# Altium schematic sheet DDR3_2.SchDoc: DDR3 memory
size 420 x 297 mm; CheckedBy: T.Janicki; CompanyName: Creotech Instruments SA; DrawnBy: G.Kasprowicz; Organization: CERN; Address1: European Organization for Nuclear Research; Address2: CH-1211 Geneve 23 - Switzerland; Revision: -; SheetNumber: 4; SheetTotal: 21; EDA_Number: EDA-xxxx; Projet: Simple VME FMC Carrier; ModifiedBy: -; CreateDate: 20/11/2012; CheckedDate: 30/04/2012; Title2: - bank 5 -; DivGrp: BE-CO; Designer: G.Kasprowicz; PageSetup: Record=PageOptions|CenterHorizontal=True|CenterVertical=True|PrintScale=0.95|XCorrection=1.00|YCorrection=1.00|PrintKind=1|BorderSize=5000000|LeftOffset=0|BottomOffset=0|Orientation=2|PaperLength=1000|PaperWidth=1000|Scale=100|PaperSource=15|PrintQuality=600|MediaType=1|DitherType=10|PaperKind=A3|PrintScaleMode=1; ModifiedDate: -
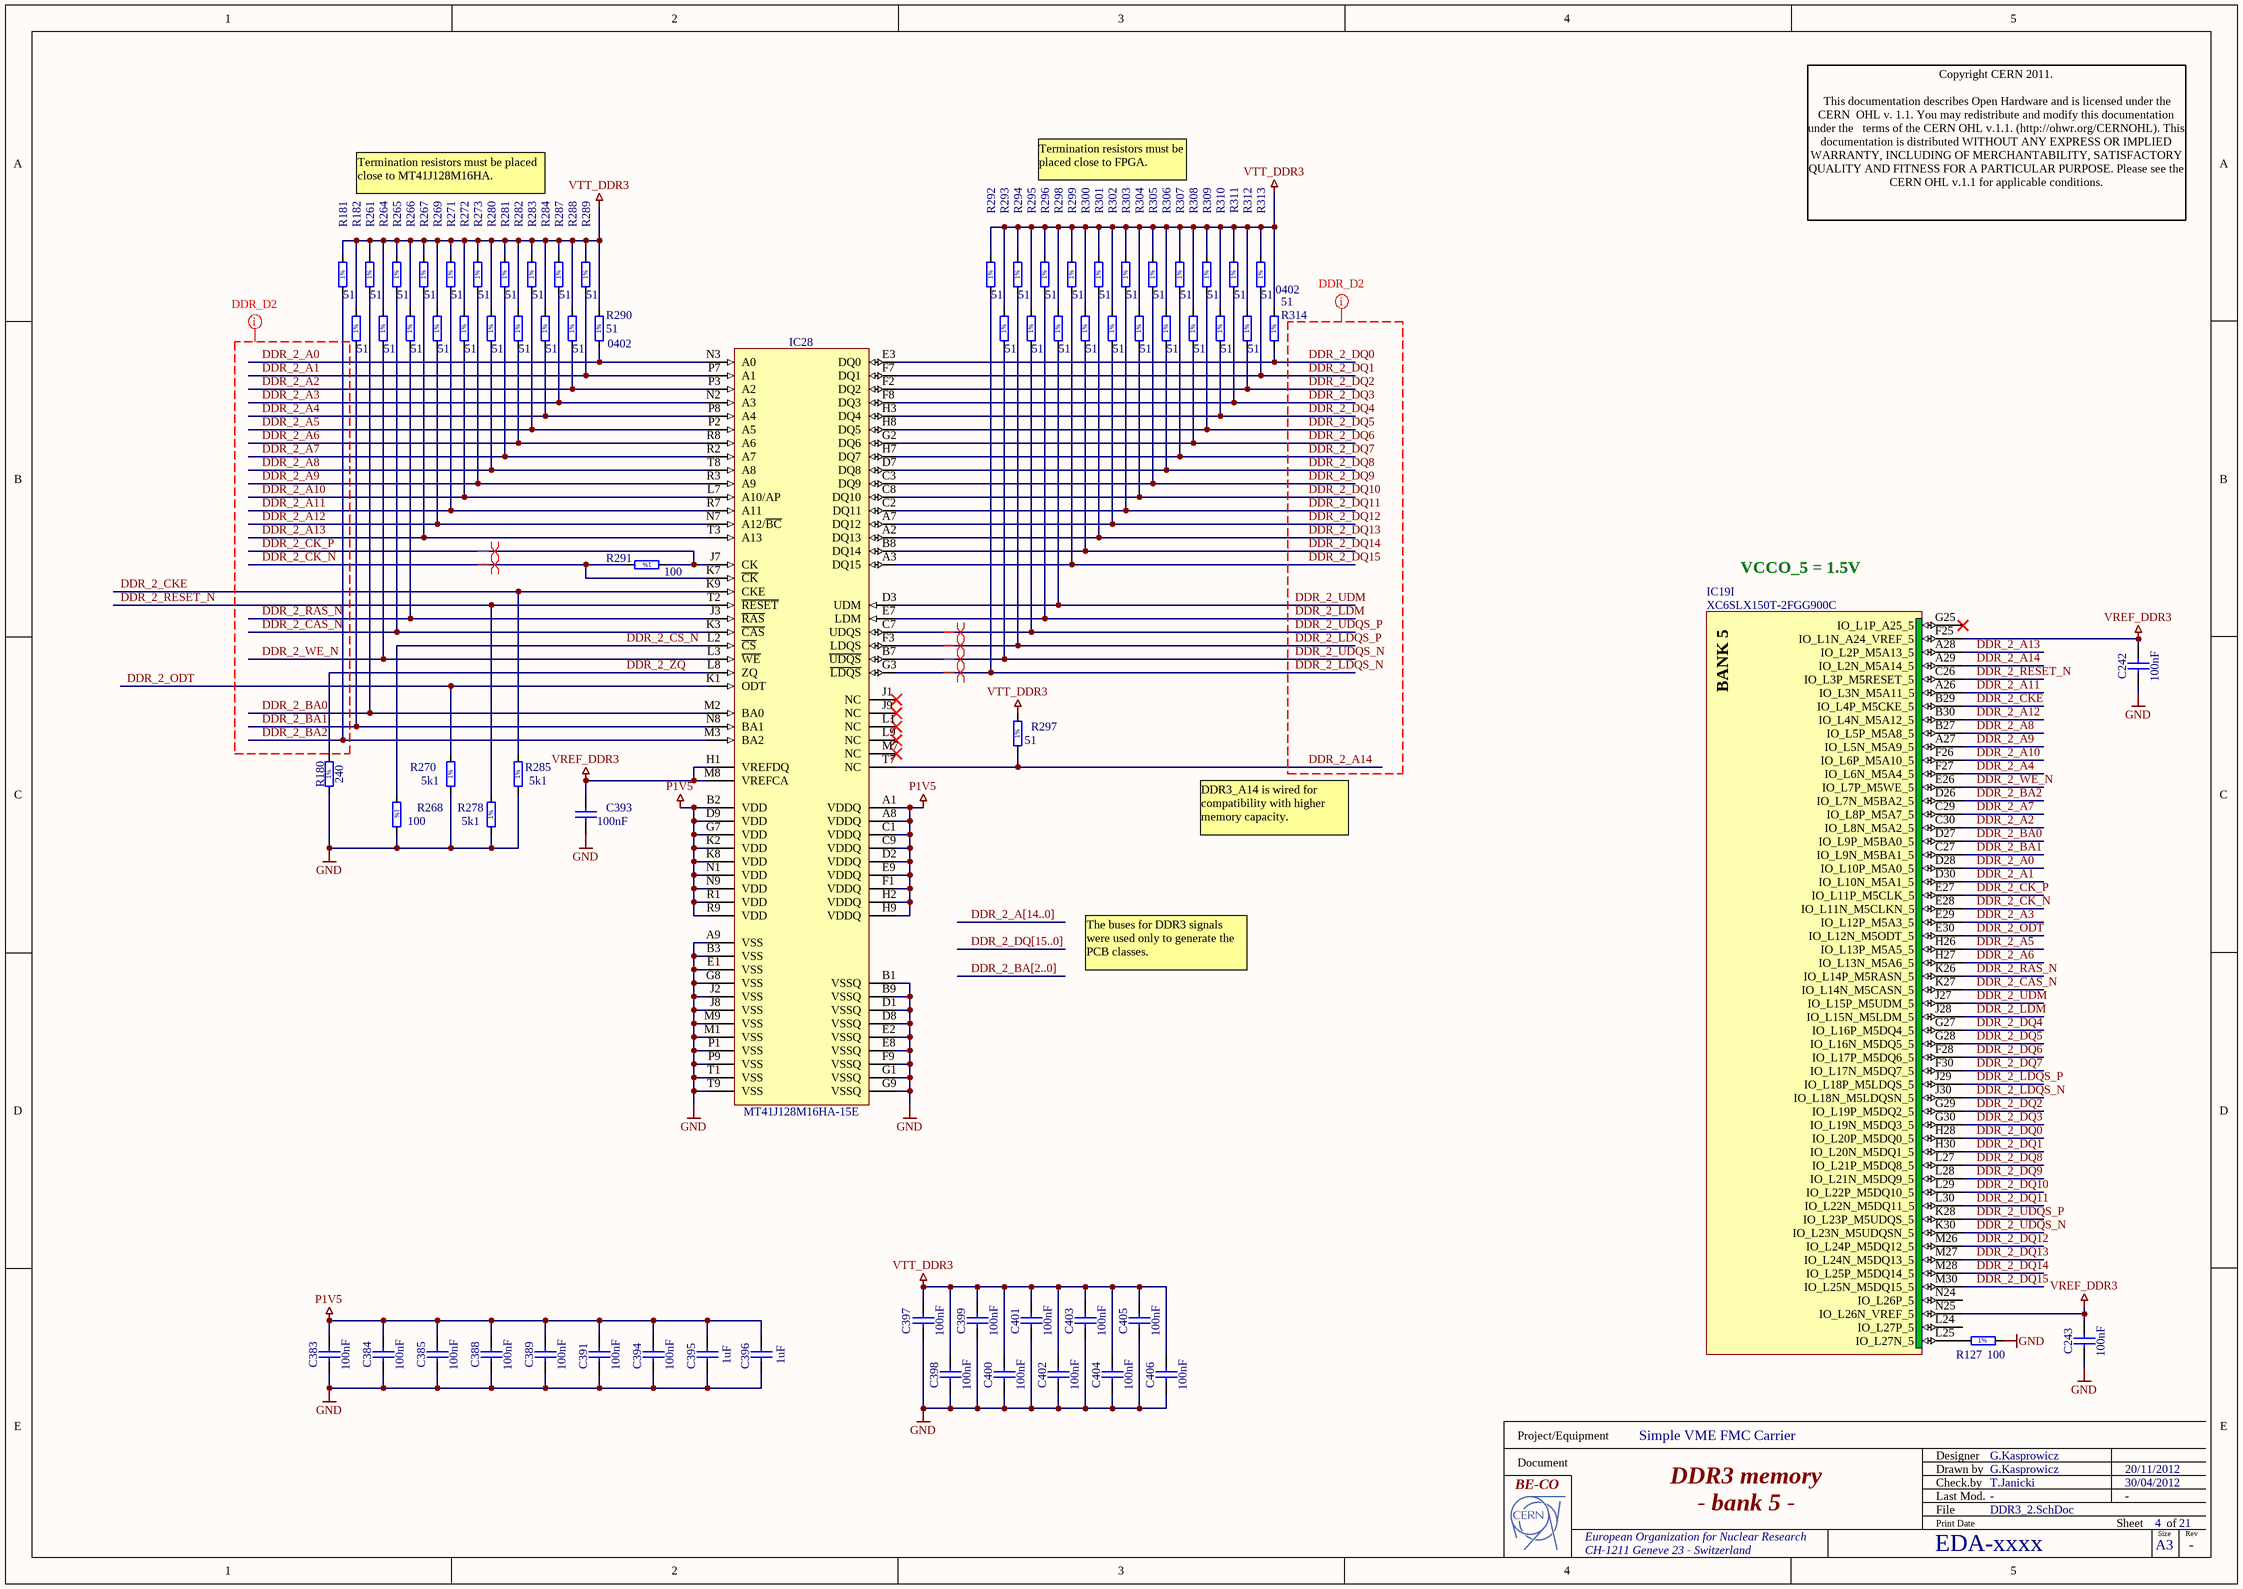
[diagram p0: DDR3_2.SchDoc]

## Parts
C242  100nF  [CAPC1005X55N]
C243  100nF  [CAPC1005X55N]
C383  100nF  [CAPC1005X55N]
C384  100nF  [CAPC1005X55N]
C385  100nF  [CAPC1005X55N]
C388  100nF  [CAPC1005X55N]
C389  100nF  [CAPC1005X55N]
C391  100nF  [CAPC1005X55N]
C393  100nF  [CAPC1005X55N]
C394  100nF  [CAPC1005X55N]
C395  1uF  [CAPC1608X87N]
C396  1uF  [CAPC1608X87N]
C397  100nF  [CAPC1005X55N]
C398  100nF  [CAPC1005X55N]
C399  100nF  [CAPC1005X55N]
C400  100nF  [CAPC1005X55N]
C401  100nF  [CAPC1005X55N]
C402  100nF  [CAPC1005X55N]
C403  100nF  [CAPC1005X55N]
C404  100nF  [CAPC1005X55N]
C405  100nF  [CAPC1005X55N]
C406  100nF  [CAPC1005X55N]
IC19  XC6SLX150T-2FGG900C  [BGA900C100P30X30_3100X3100X260]  (part I of 18)
IC28  MT41J128M16HA-15E  [BGA96C80P9X16_900X1400X120]
R127  100  [RESC1608X55N]
R180  240  [RESC1608X55N]
R181  51  [RESC1005X40N]
R182  51  [RESC1005X40N]
R261  51  [RESC1005X40N]
R264  51  [RESC1005X40N]
R265  51  [RESC1005X40N]
R266  51  [RESC1005X40N]
R267  51  [RESC1005X40N]
R268  100  [RESC1608X55N]
R269  51  [RESC1005X40N]
R270  5k1  [RESC1608X55N]
R271  51  [RESC1005X40N]
R272  51  [RESC1005X40N]
R273  51  [RESC1005X40N]
R278  5k1  [RESC1608X55N]
R280  51  [RESC1005X40N]
R281  51  [RESC1005X40N]
R282  51  [RESC1005X40N]
R283  51  [RESC1005X40N]
R284  51  [RESC1005X40N]
R285  5k1  [RESC1608X55N]
R287  51  [RESC1005X40N]
R288  51  [RESC1005X40N]
R289  51  [RESC1005X40N]
R290  51  Case: 0402  [RESC1005X40N]
R291  100  [RESC1608X55N]
R292  51  [RESC1005X40N]
R293  51  [RESC1005X40N]
R294  51  [RESC1005X40N]
R295  51  [RESC1005X40N]
R296  51  [RESC1005X40N]
R297  51  [RESC1005X40N]
R298  51  [RESC1005X40N]
R299  51  [RESC1005X40N]
R300  51  [RESC1005X40N]
R301  51  [RESC1005X40N]
R302  51  [RESC1005X40N]
R303  51  [RESC1005X40N]
R304  51  [RESC1005X40N]
R305  51  [RESC1005X40N]
R306  51  [RESC1005X40N]
R307  51  [RESC1005X40N]
R308  51  [RESC1005X40N]
R309  51  [RESC1005X40N]
R310  51  [RESC1005X40N]
R311  51  [RESC1005X40N]
R312  51  [RESC1005X40N]
R313  51  [RESC1005X40N]
R314  51  Case: 0402  [RESC1005X40N]

## Nets
GND: C242.1 C243.1 C383.1 C384.1 C385.1 C388.1 C389.1 C391.1 C393.1 C394.1 C395.1 C396.1 C397.1 C398.1 C399.1 C400.1 C401.1 C402.1 C403.1 C404.1 C405.1 C406.1 IC28.A9(VSS) IC28.B1(VSSQ) IC28.B3(VSS) IC28.B9(VSSQ) IC28.D1(VSSQ) IC28.D8(VSSQ) IC28.E1(VSS) IC28.E2(VSSQ) IC28.E8(VSSQ) IC28.F9(VSSQ) IC28.G1(VSSQ) IC28.G8(VSS) IC28.G9(VSSQ) IC28.J2(VSS) IC28.J8(VSS) IC28.M1(VSS) IC28.M9(VSS) IC28.P1(VSS) IC28.P9(VSS) IC28.T1(VSS) IC28.T9(VSS) R127.2 R180.1 R268.2 R270.1 R278.1 R285.1
P1V5: C383.2 C384.2 C385.2 C388.2 C389.2 C391.2 C394.2 C395.2 C396.2 IC28.A1(VDDQ) IC28.A8(VDDQ) IC28.B2(VDD) IC28.C1(VDDQ) IC28.C9(VDDQ) IC28.D2(VDDQ) IC28.D9(VDD) IC28.E9(VDDQ) IC28.F1(VDDQ) IC28.G7(VDD) IC28.H2(VDDQ) IC28.H9(VDDQ) IC28.K2(VDD) IC28.K8(VDD) IC28.N1(VDD) IC28.N9(VDD) IC28.R1(VDD) IC28.R9(VDD)
VREF_DDR3: C242.2 C243.2 C393.2 IC19.F25(IO_L1N_A24_VREF_5) IC19.N25(IO_L26N_VREF_5) IC28.H1(VREFDQ) IC28.M8(VREFCA)
VTT_DDR3: C397.2 C398.2 C399.2 C400.2 C401.2 C402.2 C403.2 C404.2 C405.2 C406.2 R181.2 R182.2 R261.2 R264.2 R265.2 R266.2 R267.2 R269.2 R271.2 R272.2 R273.2 R280.2 R281.2 R282.2 R283.2 R284.2 R287.2 R288.2 R289.2 R290.2 R292.2 R293.2 R294.2 R295.2 R296.2 R297.2 R298.2 R299.2 R300.2 R301.2 R302.2 R303.2 R304.2 R305.2 R306.2 R307.2 R308.2 R309.2 R310.2 R311.2 R312.2 R313.2 R314.2
DDR_2_A0: IC19.D28(IO_L10P_M5A0_5) IC28.N3(A0) R290.1
DDR_2_A1: IC19.D30(IO_L10N_M5A1_5) IC28.P7(A1) R289.1
DDR_2_A2: IC19.C30(IO_L8N_M5A2_5) IC28.P3(A2) R288.1
DDR_2_A3: IC19.E29(IO_L12P_M5A3_5) IC28.N2(A3) R287.1
DDR_2_A4: IC19.F27(IO_L6N_M5A4_5) IC28.P8(A4) R284.1
DDR_2_A5: IC19.H26(IO_L13P_M5A5_5) IC28.P2(A5) R283.1
DDR_2_A6: IC19.H27(IO_L13N_M5A6_5) IC28.R8(A6) R282.1
DDR_2_A7: IC19.C29(IO_L8P_M5A7_5) IC28.R2(A7) R281.1
DDR_2_A8: IC19.B27(IO_L5P_M5A8_5) IC28.T8(A8) R280.1
DDR_2_A9: IC19.A27(IO_L5N_M5A9_5) IC28.R3(A9) R273.1
DDR_2_A10: IC19.F26(IO_L6P_M5A10_5) IC28.L7(A10/AP) R272.1
DDR_2_A11: IC19.A26(IO_L3N_M5A11_5) IC28.R7(A11) R271.1
DDR_2_A12: IC19.B30(IO_L4N_M5A12_5) IC28.N7(A12/~{BC}) R269.1
DDR_2_A13: IC19.A28(IO_L2P_M5A13_5) IC28.T3(A13) R267.1
DDR_2_A14: IC19.A29(IO_L2N_M5A14_5) IC28.T7(NC) R297.1
DDR_2_BA0: IC19.D27(IO_L9P_M5BA0_5) IC28.M2(BA0) R261.1
DDR_2_BA1: IC19.C27(IO_L9N_M5BA1_5) IC28.N8(BA1) R182.1
DDR_2_BA2: IC19.D26(IO_L7N_M5BA2_5) IC28.M3(BA2) R181.1
DDR_2_CAS_N: IC19.K27(IO_L14N_M5CASN_5) IC28.K3(~{CAS}) R265.1
DDR_2_CK_N: IC19.E28(IO_L11N_M5CLKN_5) IC28.K7(~{CK}) R291.2
DDR_2_CK_P: IC19.E27(IO_L11P_M5CLK_5) IC28.J7(CK) R291.1
DDR_2_CKE: IC19.B29(IO_L4P_M5CKE_5) IC28.K9(CKE) R285.2
DDR_2_CS_N: IC28.L2(~{CS}) R268.1
DDR_2_DQ0: IC19.H28(IO_L20P_M5DQ0_5) IC28.E3(DQ0) R314.1
DDR_2_DQ1: IC19.H30(IO_L20N_M5DQ1_5) IC28.F7(DQ1) R313.1
DDR_2_DQ2: IC19.G29(IO_L19P_M5DQ2_5) IC28.F2(DQ2) R312.1
DDR_2_DQ3: IC19.G30(IO_L19N_M5DQ3_5) IC28.F8(DQ3) R311.1
DDR_2_DQ4: IC19.G27(IO_L16P_M5DQ4_5) IC28.H3(DQ4) R310.1
DDR_2_DQ5: IC19.G28(IO_L16N_M5DQ5_5) IC28.H8(DQ5) R309.1
DDR_2_DQ6: IC19.F28(IO_L17P_M5DQ6_5) IC28.G2(DQ6) R308.1
DDR_2_DQ7: IC19.F30(IO_L17N_M5DQ7_5) IC28.H7(DQ7) R307.1
DDR_2_DQ8: IC19.L27(IO_L21P_M5DQ8_5) IC28.D7(DQ8) R306.1
DDR_2_DQ9: IC19.L28(IO_L21N_M5DQ9_5) IC28.C3(DQ9) R305.1
DDR_2_DQ10: IC19.L29(IO_L22P_M5DQ10_5) IC28.C8(DQ10) R304.1
DDR_2_DQ11: IC19.L30(IO_L22N_M5DQ11_5) IC28.C2(DQ11) R303.1
DDR_2_DQ12: IC19.M26(IO_L24P_M5DQ12_5) IC28.A7(DQ12) R302.1
DDR_2_DQ13: IC19.M27(IO_L24N_M5DQ13_5) IC28.A2(DQ13) R301.1
DDR_2_DQ14: IC19.M28(IO_L25P_M5DQ14_5) IC28.B8(DQ14) R300.1
DDR_2_DQ15: IC19.M30(IO_L25N_M5DQ15_5) IC28.A3(DQ15) R299.1
DDR_2_LDM: IC19.J28(IO_L15N_M5LDM_5) IC28.E7(LDM) R296.1
DDR_2_LDQS_N: IC19.J30(IO_L18N_M5LDQSN_5) IC28.G3(~{LDQS}) R292.1
DDR_2_LDQS_P: IC19.J29(IO_L18P_M5LDQS_5) IC28.F3(LDQS) R294.1
DDR_2_ODT: IC19.E30(IO_L12N_M5ODT_5) IC28.K1(ODT) R270.2
DDR_2_RAS_N: IC19.K26(IO_L14P_M5RASN_5) IC28.J3(~{RAS}) R266.1
DDR_2_RESET_N: IC19.C26(IO_L3P_M5RESET_5) IC28.T2(~{RESET}) R278.2
DDR_2_UDM: IC19.J27(IO_L15P_M5UDM_5) IC28.D3(UDM) R298.1
DDR_2_UDQS_N: IC19.K30(IO_L23N_M5UDQSN_5) IC28.B7(~{UDQS}) R293.1
DDR_2_UDQS_P: IC19.K28(IO_L23P_M5UDQS_5) IC28.C7(UDQS) R295.1
DDR_2_WE_N: IC19.E26(IO_L7P_M5WE_5) IC28.L3(~{WE}) R264.1
DDR_2_ZQ: IC28.L8(ZQ) R180.2
NetIC19_L25: IC19.L25(IO_L27N_5) R127.1

Not connected (* = marked no-connect by the designer): IC19 G25(IO_L1P_A25_5)* L24(IO_L27P_5) N24(IO_L26P_5); IC28 J1(NC)* J9(NC)* L1(NC)* L9(NC)* M7(NC)*

## Buses and harness runs
bus DDR_2_A[14..0]
bus DDR_2_BA[2..0]
bus DDR_2_DQ[15..0]

## Layout directives
differential pair: DDR_2_CK_N, DDR_2_CK_P, DDR_2_LDQS_N, DDR_2_LDQS_P, DDR_2_UDQS_N, DDR_2_UDQS_P
net class DDR_D2: DDR_2_A0, DDR_2_A1, DDR_2_A2, DDR_2_A3, DDR_2_A4, DDR_2_A5, DDR_2_A6, DDR_2_A7, DDR_2_A8, DDR_2_A9, DDR_2_A10, DDR_2_A11, DDR_2_A12, DDR_2_A13, DDR_2_A14, DDR_2_BA0, DDR_2_BA1, DDR_2_BA2, DDR_2_CAS_N, DDR_2_CK_N, DDR_2_CK_P, DDR_2_DQ0, DDR_2_DQ1, DDR_2_DQ2, DDR_2_DQ3, DDR_2_DQ4, DDR_2_DQ5, DDR_2_DQ6, DDR_2_DQ7, DDR_2_DQ8, DDR_2_DQ9, DDR_2_DQ10, DDR_2_DQ11, DDR_2_DQ12, DDR_2_DQ13, DDR_2_DQ14, DDR_2_DQ15, DDR_2_LDM, DDR_2_LDQS_N, DDR_2_LDQS_P, DDR_2_RAS_N, DDR_2_UDM, DDR_2_UDQS_N, DDR_2_UDQS_P, DDR_2_WE_N

## Notes on the sheet
- Termination resistors must be placed close to MT41J128M16HA.
- Termination resistors must be placed close to FPGA.
- Copyright CERN 2011.
  This documentation describes Open Hardware and is licensed under the CERN  OHL v. 1.1. You may redistribute and modify this documentation under the   terms of the CERN OHL v.1.1. (http://ohwr.org/CERNOHL). This  documentation is distributed WITHOUT ANY EXPRESS OR IMPLIED  WARRANTY, INCLUDING OF MERCHANTABILITY, SATISFACTORY  QUALITY AND FITNESS FOR A PARTICULAR PURPOSE. Please see the  CERN OHL v.1.1 for applicable conditions.
- VCCO_5 = 1.5V
- DDR3_A14 is wired for compatibility with higher memory capacity.
- The buses for DDR3 signals were used only to generate the PCB classes.
- Project/Equipment
- Document
- Designer
- Drawn by
- Check.by
- File
- Last Mod.
- Print Date
- Sheet
- Size
- A3
- of
- Rev
- (in symbol R0402_51R_1%_0.0625W_100PPM) 1%
- (in symbol R0603_5K1_1%_0.1W_100PPM) 1%
- (in symbol R0603_100R_1%_0.1W_100PPM) 1%
- (in symbol R0603_240R_1%_0.1W_100PPM) 1%
- (in symbol XC6SLX150T-2FGG900C, part I) BANK 5

## Library data of the parts
C242 C243 C391 C394 = CC0402_100NF_16V_10%_X7R: Non-polarised capacitor; Part Description: SMD Multilayer Chip Ceramic Capacitor; Manufacturer: GENERIC; Manufacturer1 Part Number: 223878715649; Voltage: 16V; TC: X7R; Tolerance: ±10%; Table: Capacitors SMD; Part Number: CC0402_100NF_16V_10%_X7R; Component Kind: Standard; Component Type: Standard; Pin Count: 2; Value: 100nF; Status: Not Recommended; Manufacturer Part Number: CC0402_100NF_16V_10%_X7R; Case: 0402; Mounted: Yes; Socket: No; SMD: Yes; Manufacturer1 Example: PHYCOMP; Manufacturer1 ComponentHeight: 0.55mm; HelpURL: \\cern.ch\dfs\Applications\Altium\Datasheets\CC0402_X7R_PHYCOMP.pdf; Author: CERN DEM JLC; CreateDate: 03/12/2007; LatestRevisionDate: 03/12/2007
C383-C385 C388 C389 C393 C397-C406 = CC0402_100NF_16V_10%_X7R: Non-polarised capacitor; Part Description: SMD Multilayer Chip Ceramic Capacitor; Manufacturer: GENERIC; Manufacturer1 Part Number: 223878715649; Manufacturer1 Datasheet: \\cern.ch\dfs\Applications\Altium\Datasheets\CC0402_X7R_PHYCOMP.pdf; Voltage: 16V; TC: X7R; Tolerance: ±10%; Table: Capacitors SMD; Part Number: CC0402_100NF_16V_10%_X7R; Component Kind: Standard; Component Type: Standard; Designator: Capacitor - non polarized; Library Reference: Capacitor - non polarized; Pin Count: 2; Value: 100nF; Status: Not Recommended; Manufacturer Part Number: CC0402_100NF_16V_10%_X7R; Case: 0402; Mounted: Yes; Socket: No; SMD: Yes; Manufacturer1 Example: PHYCOMP; Manufacturer1 ComponentHeight: 0.55mm; HelpURL: \\cern.ch\dfs\Applications\Altium\Datasheets\CC0402_X7R_PHYCOMP.pdf; Author: CERN DEM JLC; CreateDate: 12/3/2007; LatestRevisionDate: 12/3/2007
C395 C396 = CC0603_1UF_16V_10%_X7R: Non-polarised capacitor; Part Description: SMD Multilayer Chip Ceramic Capacitor; Manufacturer: GENERIC; Manufacturer1 Part Number: 223824613663; Voltage: 16V; TC: X7R; Tolerance: ±10%; Table: Capacitors SMD; Part Number: CC0603_1UF_16V_10%_X7R; Component Kind: Standard; Component Type: Standard; Pin Count: 2; Value: 1uF; Status: Preferred; Manufacturer Part Number: CC0603_1uF_16V_10%_X7R; Case: 0603; Mounted: Yes; Socket: No; SMD: Yes; Manufacturer1 Example: PHYCOMP; Manufacturer1 ComponentHeight: 0.87mm; HelpURL: \\cern.ch\dfs\Applications\Altium\Datasheets\CC0805_X5R_PHYCOMP_HC.pdf; Author: CERN DEM JLC; CreateDate: 03/12/2007; LatestRevisionDate: 03/12/2007
IC19 = XC6SLX150T-2FGG900C: SPARTAN-6, FPGA, 900-Ball BGA, Commercial Grade, Pb-Free; Part Description: SPARTAN-6, FPGA, 540 User I/Os, 8 GTPs, 900-Ball BGA, Commercial Grade, Pb-Free; Manufacturer: XILINX; Table: Logic; Part Number: XC6SLX150T-2FGG900C; Component Kind: Standard; Component Type: Standard; Device: XC6SLX150T-2FGG900C; PackageDescription: BGA,1.00mm pitch, square; 900 pin, 30 columns X 30 rows, 31.00mm X 31.00mm X 2.60mm H, IPC Medium Density; Manufacturer Part Number: XC6SLX150T-2FGG900C; Pin Count: 900; Case: BGA900; Mounted: Yes; Socket: No; SMD: Yes; ComponentHeight: 2.6mm; HelpURL: \\cern.ch\dfs\Applications\Altium\Datasheets\XC6SLX150T-2FGG900C.pdf; ComponentLink1URL: \\cern.ch\dfs\Applications\Altium\Datasheets\XC6SLX150T-2FGG900C_Package-Pinouts.pdf; ComponentLink1Description: Package/Pinouts; Author: CERN DEM JLC; CreateDate: 2009-11-17; LatestRevisionDate: 2009-11-17
IC28 = MT41J128M16HA-15E: 16 Meg x 16 x 8 Banks DDR3 SDRAM; Part Description: 16 Meg x 16 x 8 Banks DDR3 SDRAM, +1.5V Supply; Manufacturer: MICRON TECHNOLOGY; Table: Logic; Part Number: MT41J128M16HA-15E; Component Kind: Standard; Component Type: Standard; Designator: MT41J128M16HA; Device: MT41J128M16HA-15E; Library Reference: MT41J128M16HA; PackageDescription: BGA 0.8mm, Pitch, Square 96 Pin, 9 Columns x 16 Rows, Body 14mm X 9mm X 1.2mm H; Manufacturer Part Number: MT41J128M16HA-15E; Pin Count: 96; Case: BGA96; Mounted: Yes; Socket: No; SMD: Yes; ComponentHeight: 1.2mm; Datasheet: \\cern.ch\dfs\Applications\Altium\Datasheets\MT41J128M16HA-15E.pdf; HelpURL: \\cern.ch\dfs\Applications\Altium\Datasheets\MT41J128M16HA-15E.pdf; Author: CERN DEM JLC; CreateDate: 11/19/2009; LatestRevisionDate: 11/19/2009
R127 R268 R291 = R0603_100R_1%_0.1W_100PPM: Resistor - 1%; Part Description: General Purpose Thick Film Chip Resistor; Manufacturer: GENERIC; Manufacturer1 Part Number: NRC06F4700TRF; Power: 0.1W; TC: ±100ppm/°C; Table: Resistors SMD; Part Number: R0603_100R_1%_0.1W_100PPM; Component Kind: Standard; Component Type: Standard; Pin Count: 2; Value: 100; Status: Preferred; Tolerance: ±1%; Manufacturer Part Number: R0603_100R_1%_0.1W_100PPM; Case: 0603; Mounted: Yes; Socket: No; SMD: Yes; Manufacturer1 Example: NIC COMPONENT; Manufacturer1 ComponentHeight: 0.55mm; HelpURL: \\cern.ch\dfs\Applications\Altium\Datasheets\R0603_NIC_NRC.pdf; Author: CERN DEM JLC; CreateDate: 2007-12-03; LatestRevisionDate: 2008-03-13
R180 = R0603_240R_1%_0.1W_100PPM: Resistor - 1%; Part Description: General Purpose Thick Film Chip Resistor; Manufacturer: GENERIC; Manufacturer1 Part Number: NRC06F2400TRF; Power: 0.1W; TC: ±100ppm/°C; Table: Resistors SMD; Part Number: R0603_240R_1%_0.1W_100PPM; Component Kind: Standard; Component Type: Standard; Pin Count: 2; Value: 240; Status: Preferred; Tolerance: ±1%; Manufacturer Part Number: R0603_240R_1%_0.1W_100PPM; Case: 0603; Mounted: Yes; Socket: No; SMD: Yes; Manufacturer1 Example: NIC COMPONENT; Manufacturer1 ComponentHeight: 0.55mm; HelpURL: \\cern.ch\dfs\Applications\Altium\Datasheets\R0603_NIC_NRC.pdf; Author: CERN DEM JLC; CreateDate: 12/3/2007; LatestRevisionDate: 3/13/2008
R181 R182 R261 R264-R267 R269 R271-R273 R280-R284 R287-R290 R292-R314 = R0402_51R_1%_0.0625W_100PPM: Resistor - 1%; Part Description: General Purpose Thick Film Chip Resistor; Manufacturer: GENERIC; Manufacturer1 Part Number: 232270675109; TC: ±100ppm/°C; Table: Resistors SMD; Part Number: R0402_51R_1%_0.0625W_100PPM; Component Kind: Standard; Component Type: Standard; Pin Count: 2; Value: 51; Status: Not recommended; Power: 0.0625W; Tolerance: ±1%; Manufacturer Part Number: R0402_51R_1%_0.0625W_100PPM; Mounted: Yes; Socket: No; SMD: Yes; Manufacturer1 Example: PHYCOMP; Manufacturer1 ComponentHeight: 0.4mm; HelpURL: \\cern.ch\dfs\Applications\Altium\Datasheets\R0402_Phycomp_RC0402.pdf; Author: CERN DEM JLC; CreateDate: 03/12/2007; LatestRevisionDate: 13/03/2008
  R181 R182 R261 R264-R267 R269 R271-R273 R280-R284 R287-R289 R292-R313: Case: 0402
R270 R278 R285 = R0603_5K1_1%_0.1W_100PPM: Resistor - 1%; Part Description: General Purpose Thick Film Chip Resistor; Manufacturer: GENERIC; Manufacturer1 Part Number: NRC06F5101TRF; Power: 0.1W; TC: ±100ppm/°C; Table: Resistors SMD; Part Number: R0603_5K1_1%_0.1W_100PPM; Component Kind: Standard; Component Type: Standard; Pin Count: 2; Value: 5k1; Status: Preferred; Tolerance: ±1%; Manufacturer Part Number: R0603_5K1_1%_0.1W_100PPM; Case: 0603; Mounted: Yes; Socket: No; SMD: Yes; Manufacturer1 Example: NIC COMPONENT; Manufacturer1 ComponentHeight: 0.55mm; HelpURL: \\cern.ch\dfs\Applications\Altium\Datasheets\R0603_NIC_NRC.pdf; Author: CERN DEM JLC; CreateDate: 03/12/2007; LatestRevisionDate: 13/03/2008